# EAGLE schematic registers_manual (EAGLE 9.5.2)
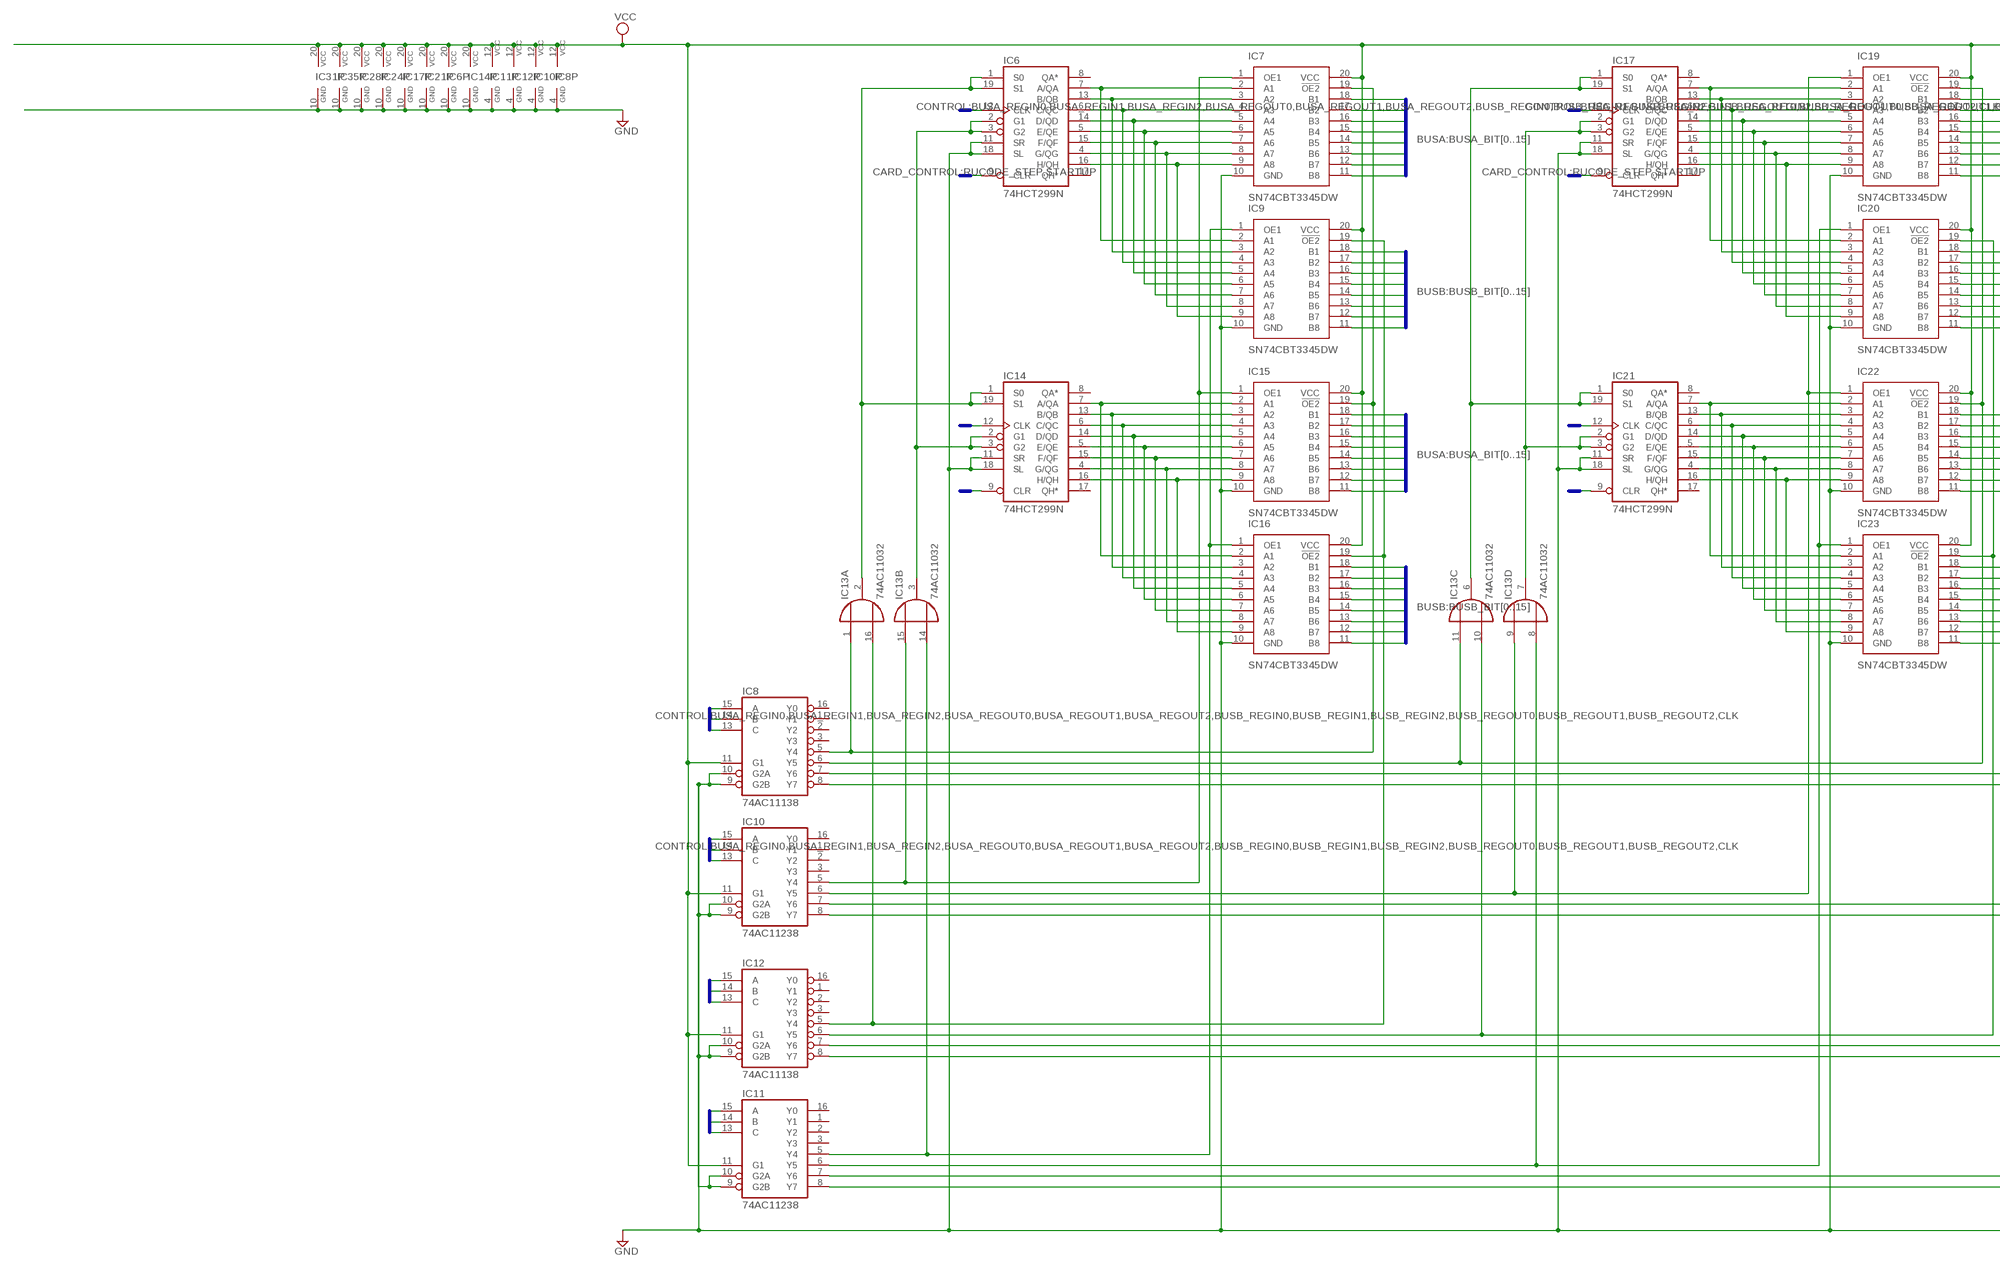
[diagram p0: schematic, sheet 1, part 1 of 2]
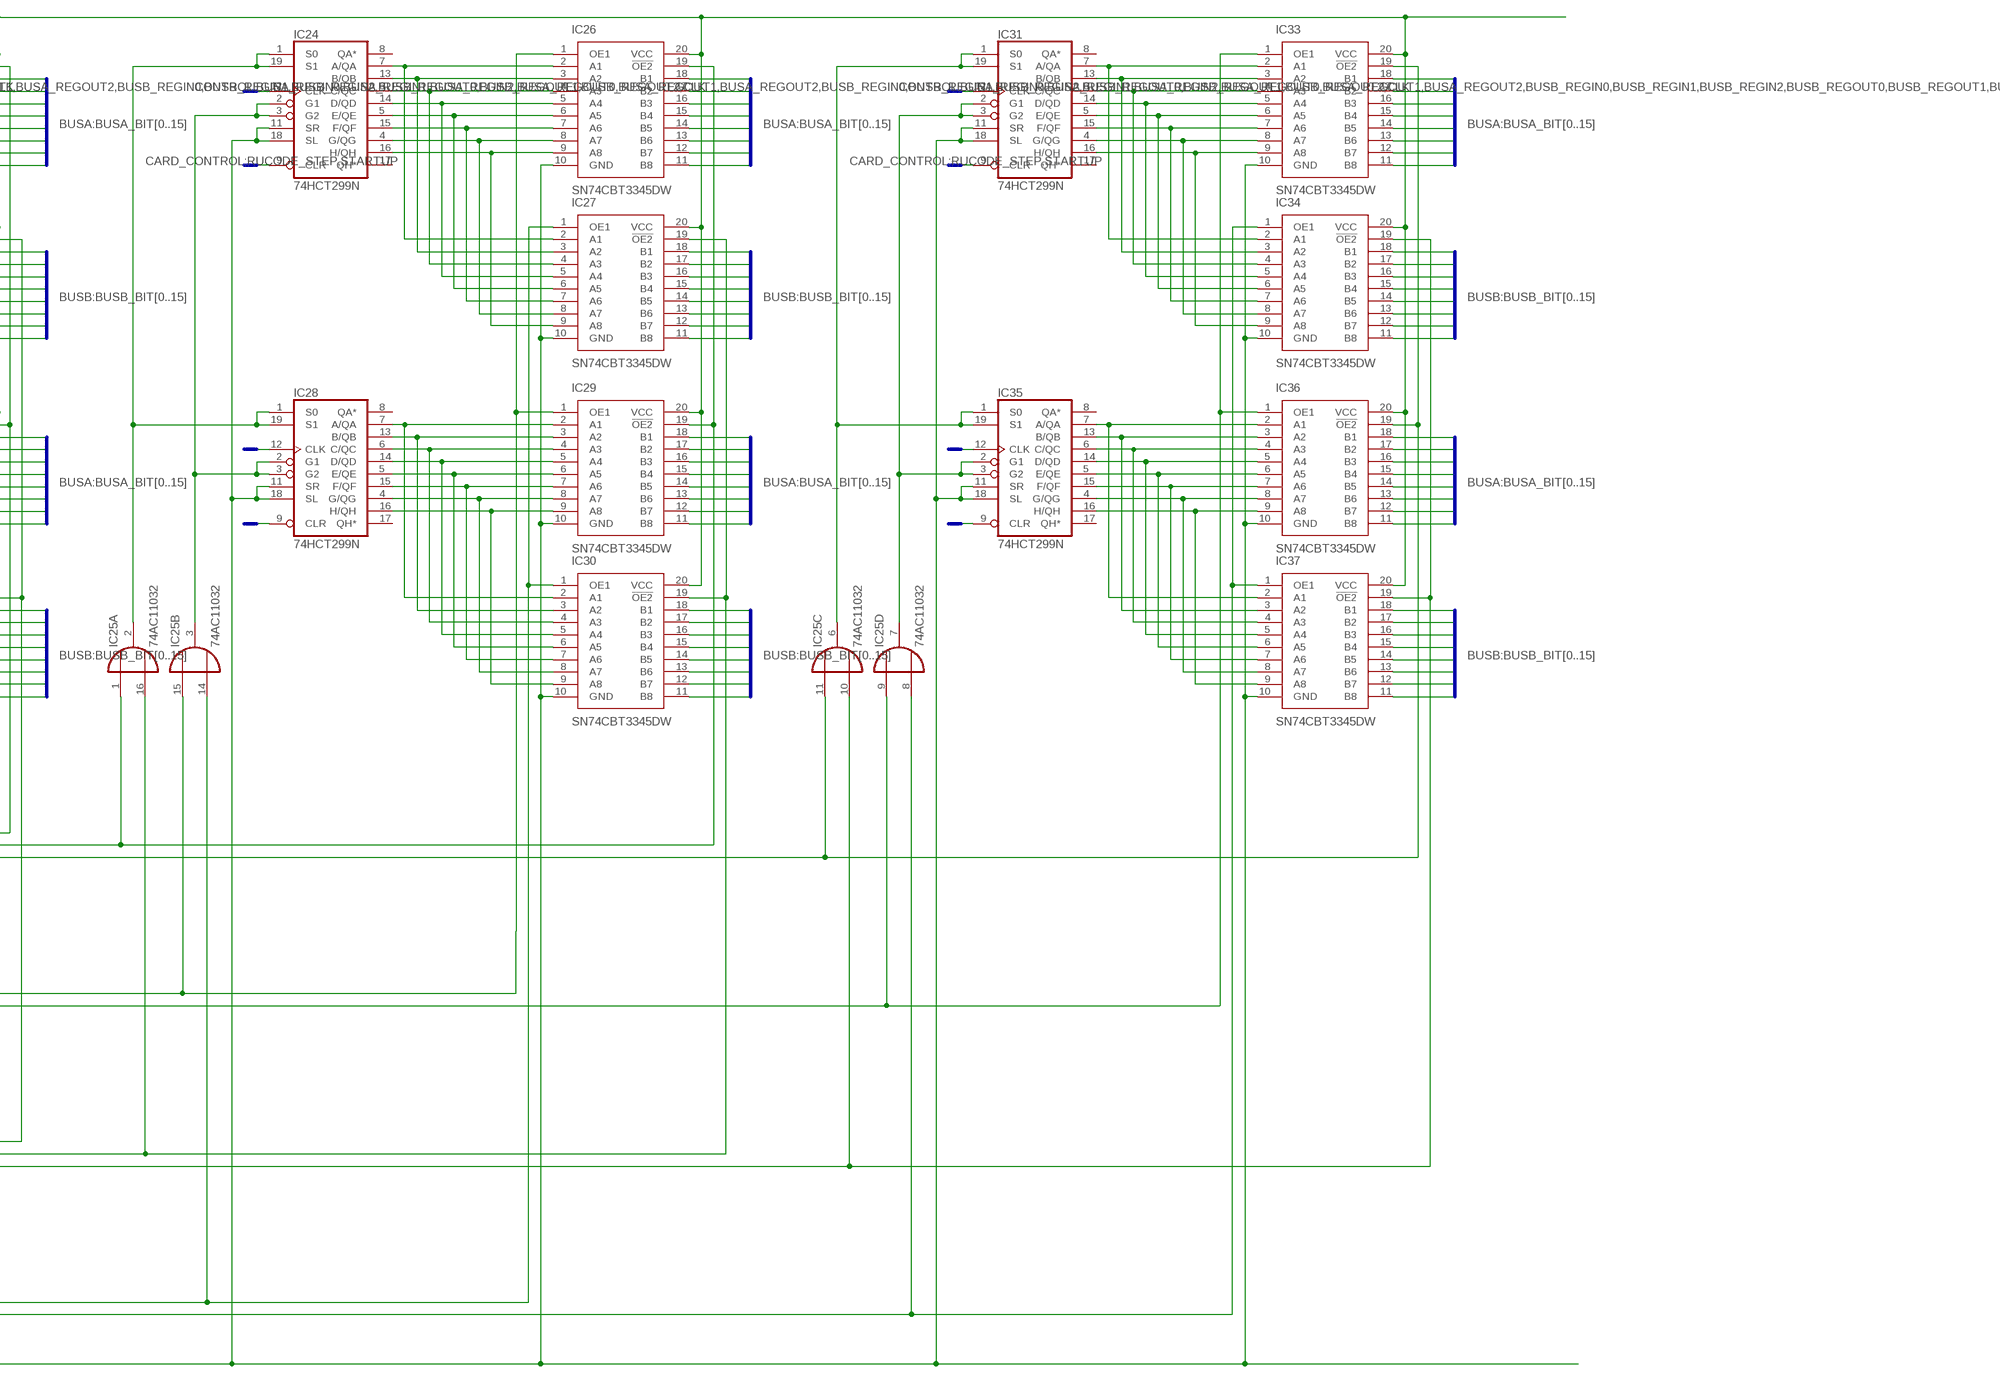
[diagram p1: schematic, sheet 1, part 2 of 2]

## Parts
IC6  74HCT299N  [DIL20]
IC7  SN74CBT3345DW  [SOIC127P1030X265-20N]
IC8  74AC11138  [DIL16]
IC9  SN74CBT3345DW  [SOIC127P1030X265-20N]
IC10  74AC11238  [DIL16]
IC11  74AC11238  [DIL16]
IC12  74AC11138  [DIL16]
IC13  74AC11032  [DIL16]
IC14  74HCT299N  [DIL20]
IC15  SN74CBT3345DW  [SOIC127P1030X265-20N]
IC16  SN74CBT3345DW  [SOIC127P1030X265-20N]
IC17  74HCT299N  [DIL20]
IC19  SN74CBT3345DW  [SOIC127P1030X265-20N]
IC20  SN74CBT3345DW  [SOIC127P1030X265-20N]
IC21  74HCT299N  [DIL20]
IC22  SN74CBT3345DW  [SOIC127P1030X265-20N]
IC23  SN74CBT3345DW  [SOIC127P1030X265-20N]
IC24  74HCT299N  [DIL20]
IC25  74AC11032  [DIL16]
IC26  SN74CBT3345DW  [SOIC127P1030X265-20N]
IC27  SN74CBT3345DW  [SOIC127P1030X265-20N]
IC28  74HCT299N  [DIL20]
IC29  SN74CBT3345DW  [SOIC127P1030X265-20N]
IC30  SN74CBT3345DW  [SOIC127P1030X265-20N]
IC31  74HCT299N  [DIL20]
IC33  SN74CBT3345DW  [SOIC127P1030X265-20N]
IC34  SN74CBT3345DW  [SOIC127P1030X265-20N]
IC35  74HCT299N  [DIL20]
IC36  SN74CBT3345DW  [SOIC127P1030X265-20N]
IC37  SN74CBT3345DW  [SOIC127P1030X265-20N]

## Nets
BUSA_BIT0: IC7.18(B1) IC19.18(B1) IC26.18(B1) IC33.18(B1)
BUSA_BIT1: IC7.17(B2) IC19.17(B2) IC26.17(B2) IC33.17(B2)
BUSA_BIT2: IC7.16(B3) IC19.16(B3) IC26.16(B3) IC33.16(B3)
BUSA_BIT3: IC7.15(B4) IC19.15(B4) IC26.15(B4) IC33.15(B4)
BUSA_BIT4: IC7.14(B5) IC19.14(B5) IC26.14(B5) IC33.14(B5)
BUSA_BIT5: IC7.13(B6) IC19.13(B6) IC26.13(B6) IC33.13(B6)
BUSA_BIT6: IC7.12(B7) IC19.12(B7) IC26.12(B7) IC33.12(B7)
BUSA_BIT7: IC7.11(B8) IC19.11(B8) IC26.11(B8) IC33.11(B8)
BUSA_BIT8: IC15.18(B1) IC22.18(B1) IC29.18(B1) IC36.18(B1)
BUSA_BIT9: IC15.17(B2) IC22.17(B2) IC29.17(B2) IC36.17(B2)
BUSA_BIT10: IC15.16(B3) IC22.16(B3) IC29.16(B3) IC36.16(B3)
BUSA_BIT11: IC15.15(B4) IC22.15(B4) IC29.15(B4) IC36.15(B4)
BUSA_BIT12: IC15.14(B5) IC22.14(B5) IC29.14(B5) IC36.14(B5)
BUSA_BIT13: IC15.13(B6) IC22.13(B6) IC29.13(B6) IC36.13(B6)
BUSA_BIT14: IC15.12(B7) IC22.12(B7) IC29.12(B7) IC36.12(B7)
BUSA_BIT15: IC15.11(B8) IC22.11(B8) IC29.11(B8) IC36.11(B8)
BUSA_REGIN0: IC8.15(A)
BUSA_REGIN1: IC8.14(B)
BUSA_REGIN2: IC8.13(C)
BUSA_REGOUT0: IC10.15(A)
BUSA_REGOUT1: IC10.14(B)
BUSA_REGOUT2: IC10.13(C)
BUSB_BIT0: IC9.18(B1) IC20.18(B1) IC27.18(B1) IC34.18(B1)
BUSB_BIT1: IC9.17(B2) IC20.17(B2) IC27.17(B2) IC34.17(B2)
BUSB_BIT2: IC9.16(B3) IC20.16(B3) IC27.16(B3) IC34.16(B3)
BUSB_BIT3: IC9.15(B4) IC20.15(B4) IC27.15(B4) IC34.15(B4)
BUSB_BIT4: IC9.14(B5) IC20.14(B5) IC27.14(B5) IC34.14(B5)
BUSB_BIT5: IC9.13(B6) IC20.13(B6) IC27.13(B6) IC34.13(B6)
BUSB_BIT6: IC9.12(B7) IC20.12(B7) IC27.12(B7) IC34.12(B7)
BUSB_BIT7: IC9.11(B8) IC20.11(B8) IC27.11(B8) IC34.11(B8)
BUSB_BIT8: IC16.18(B1) IC23.18(B1) IC30.18(B1) IC37.18(B1)
BUSB_BIT9: IC16.17(B2) IC23.17(B2) IC30.17(B2) IC37.17(B2)
BUSB_BIT10: IC16.16(B3) IC23.16(B3) IC30.16(B3) IC37.16(B3)
BUSB_BIT11: IC16.15(B4) IC23.15(B4) IC30.15(B4) IC37.15(B4)
BUSB_BIT12: IC16.14(B5) IC23.14(B5) IC30.14(B5) IC37.14(B5)
BUSB_BIT13: IC16.13(B6) IC23.13(B6) IC30.13(B6) IC37.13(B6)
BUSB_BIT14: IC16.12(B7) IC23.12(B7) IC30.12(B7) IC37.12(B7)
BUSB_BIT15: IC16.11(B8) IC23.11(B8) IC30.11(B8) IC37.11(B8)
BUSB_REGIN0: IC12.15(A)
BUSB_REGIN1: IC12.14(B)
BUSB_REGIN2: IC12.13(C)
BUSB_REGOUT0: IC11.15(A)
BUSB_REGOUT1: IC11.14(B)
BUSB_REGOUT2: IC11.13(C)
CLK: IC6.12(CLK) IC14.12(CLK) IC17.12(CLK) IC21.12(CLK) IC24.12(CLK) IC28.12(CLK) IC31.12(CLK) IC35.12(CLK)
GND: IC6.10(GND) IC6.11(SR) IC6.18(SL) IC7.10(GND) IC8.4(GND) IC8.9(G2B) IC8.10(G2A) IC9.10(GND) IC10.4(GND) IC10.9(G2B) IC10.10(G2A) IC11.4(GND) IC11.9(G2B) IC11.10(G2A) IC12.4(GND) IC12.9(G2B) IC12.10(G2A) IC14.10(GND) IC14.11(SR) IC14.18(SL) IC15.10(GND) IC16.10(GND) IC17.10(GND) IC17.11(SR) IC17.18(SL) IC19.10(GND) IC20.10(GND) IC21.10(GND) IC21.11(SR) IC21.18(SL) IC22.10(GND) IC23.10(GND) IC24.10(GND) IC24.11(SR) IC24.18(SL) IC26.10(GND) IC27.10(GND) IC28.10(GND) IC28.11(SR) IC28.18(SL) IC29.10(GND) IC30.10(GND) IC31.10(GND) IC31.11(SR) IC31.18(SL) IC33.10(GND) IC34.10(GND) IC35.10(GND) IC35.11(SR) IC35.18(SL) IC36.10(GND) IC37.10(GND)
N$8: IC6.7(A/QA) IC7.2(A1) IC9.2(A1)
N$10: IC7.19(!OE2) IC8.5(Y4) IC13.1(A:I1) IC15.19(!OE2)
N$18: IC6.13(B/QB) IC7.3(A2) IC9.3(A2)
N$19: IC6.2(G1) IC6.3(G2) IC13.3(B:O) IC14.2(G1) IC14.3(G2)
N$20: IC6.6(C/QC) IC7.4(A3) IC9.4(A3)
N$21: IC6.1(S0) IC6.19(S1) IC13.2(A:O) IC14.1(S0) IC14.19(S1)
N$22: IC14.7(A/QA) IC15.2(A1) IC16.2(A1)
N$23: IC14.13(B/QB) IC15.3(A2) IC16.3(A2)
N$24: IC14.6(C/QC) IC15.4(A3) IC16.4(A3)
N$25: IC8.7(Y6) IC25.1(A:I1) IC26.19(!OE2) IC29.19(!OE2)
N$26: IC6.14(D/QD) IC7.5(A4) IC9.5(A4)
N$27: IC6.5(E/QE) IC7.6(A5) IC9.6(A5)
N$28: IC14.14(D/QD) IC15.5(A4) IC16.5(A4)
N$29: IC14.5(E/QE) IC15.6(A5) IC16.6(A5)
N$30: IC14.15(F/QF) IC15.7(A6) IC16.7(A6)
N$31: IC14.4(G/QG) IC15.8(A7) IC16.8(A7)
N$32: IC9.1(OE1) IC11.5(Y4) IC13.14(B:I2) IC16.1(OE1)
N$33: IC9.19(!OE2) IC12.5(Y4) IC13.16(A:I2) IC16.19(!OE2)
N$34: IC7.1(OE1) IC10.5(Y4) IC13.15(B:I1) IC15.1(OE1)
N$35: IC14.16(H/QH) IC15.9(A8) IC16.9(A8)
N$41: IC6.15(F/QF) IC7.7(A6) IC9.7(A6)
N$43: IC6.4(G/QG) IC7.8(A7) IC9.8(A7)
N$44: IC13.6(C:O) IC17.1(S0) IC17.19(S1) IC21.1(S0) IC21.19(S1)
N$45: IC17.7(A/QA) IC19.2(A1) IC20.2(A1)
N$46: IC17.13(B/QB) IC19.3(A2) IC20.3(A2)
N$47: IC6.16(H/QH) IC7.9(A8) IC9.9(A8)
N$48: IC17.6(C/QC) IC19.4(A3) IC20.4(A3)
N$49: IC17.14(D/QD) IC19.5(A4) IC20.5(A4)
N$50: IC17.5(E/QE) IC19.6(A5) IC20.6(A5)
N$51: IC17.15(F/QF) IC19.7(A6) IC20.7(A6)
N$52: IC17.4(G/QG) IC19.8(A7) IC20.8(A7)
N$53: IC17.16(H/QH) IC19.9(A8) IC20.9(A8)
N$54: IC13.7(D:O) IC17.2(G1) IC17.3(G2) IC21.2(G1) IC21.3(G2)
N$56: IC21.7(A/QA) IC22.2(A1) IC23.2(A1)
N$57: IC21.13(B/QB) IC22.3(A2) IC23.3(A2)
N$58: IC21.6(C/QC) IC22.4(A3) IC23.4(A3)
N$59: IC21.14(D/QD) IC22.5(A4) IC23.5(A4)
N$60: IC21.5(E/QE) IC22.6(A5) IC23.6(A5)
N$61: IC21.15(F/QF) IC22.7(A6) IC23.7(A6)
N$62: IC21.4(G/QG) IC22.8(A7) IC23.8(A7)
N$63: IC21.16(H/QH) IC22.9(A8) IC23.9(A8)
N$69: IC24.1(S0) IC24.19(S1) IC25.2(A:O) IC28.1(S0) IC28.19(S1)
N$70: IC24.7(A/QA) IC26.2(A1) IC27.2(A1)
N$71: IC24.13(B/QB) IC26.3(A2) IC27.3(A2)
N$72: IC24.6(C/QC) IC26.4(A3) IC27.4(A3)
N$73: IC24.14(D/QD) IC26.5(A4) IC27.5(A4)
N$74: IC24.5(E/QE) IC26.6(A5) IC27.6(A5)
N$75: IC24.15(F/QF) IC26.7(A6) IC27.7(A6)
N$76: IC24.4(G/QG) IC26.8(A7) IC27.8(A7)
N$77: IC24.16(H/QH) IC26.9(A8) IC27.9(A8)
N$78: IC24.2(G1) IC24.3(G2) IC25.3(B:O) IC28.2(G1) IC28.3(G2)
N$80: IC28.7(A/QA) IC29.2(A1) IC30.2(A1)
N$81: IC28.13(B/QB) IC29.3(A2) IC30.3(A2)
N$82: IC28.6(C/QC) IC29.4(A3) IC30.4(A3)
N$83: IC28.14(D/QD) IC29.5(A4) IC30.5(A4)
N$84: IC28.5(E/QE) IC29.6(A5) IC30.6(A5)
N$85: IC28.15(F/QF) IC29.7(A6) IC30.7(A6)
N$86: IC28.4(G/QG) IC29.8(A7) IC30.8(A7)
N$87: IC28.16(H/QH) IC29.9(A8) IC30.9(A8)
N$93: IC25.6(C:O) IC31.1(S0) IC31.19(S1) IC35.1(S0) IC35.19(S1)
N$94: IC31.7(A/QA) IC33.2(A1) IC34.2(A1)
N$95: IC31.13(B/QB) IC33.3(A2) IC34.3(A2)
N$96: IC31.6(C/QC) IC33.4(A3) IC34.4(A3)
N$97: IC31.14(D/QD) IC33.5(A4) IC34.5(A4)
N$98: IC31.5(E/QE) IC33.6(A5) IC34.6(A5)
N$99: IC31.15(F/QF) IC33.7(A6) IC34.7(A6)
N$100: IC31.4(G/QG) IC33.8(A7) IC34.8(A7)
N$101: IC31.16(H/QH) IC33.9(A8) IC34.9(A8)
N$102: IC25.7(D:O) IC31.2(G1) IC31.3(G2) IC35.2(G1) IC35.3(G2)
N$104: IC35.7(A/QA) IC36.2(A1) IC37.2(A1)
N$105: IC35.13(B/QB) IC36.3(A2) IC37.3(A2)
N$106: IC35.6(C/QC) IC36.4(A3) IC37.4(A3)
N$107: IC35.14(D/QD) IC36.5(A4) IC37.5(A4)
N$108: IC35.5(E/QE) IC36.6(A5) IC37.6(A5)
N$109: IC35.15(F/QF) IC36.7(A6) IC37.7(A6)
N$110: IC35.4(G/QG) IC36.8(A7) IC37.8(A7)
N$111: IC35.16(H/QH) IC36.9(A8) IC37.9(A8)
N$112: IC8.6(Y5) IC13.11(C:I1) IC19.19(!OE2) IC22.19(!OE2)
N$113: IC10.6(Y5) IC13.9(D:I1) IC19.1(OE1) IC22.1(OE1)
N$114: IC12.6(Y5) IC13.10(C:I2) IC20.19(!OE2) IC23.19(!OE2)
N$115: IC11.6(Y5) IC13.8(D:I2) IC20.1(OE1) IC23.1(OE1)
N$117: IC10.7(Y6) IC25.15(B:I1) IC26.1(OE1) IC29.1(OE1)
N$118: IC12.7(Y6) IC25.16(A:I2) IC27.19(!OE2) IC30.19(!OE2)
N$119: IC11.7(Y6) IC25.14(B:I2) IC27.1(OE1) IC30.1(OE1)
N$120: IC11.8(Y7) IC25.8(D:I2) IC34.1(OE1) IC37.1(OE1)
N$121: IC12.8(Y7) IC25.10(C:I2) IC34.19(!OE2) IC37.19(!OE2)
N$122: IC8.8(Y7) IC25.11(C:I1) IC33.19(!OE2) IC36.19(!OE2)
N$123: IC10.8(Y7) IC25.9(D:I1) IC33.1(OE1) IC36.1(OE1)
STARTUP: IC6.9(CLR) IC14.9(CLR) IC17.9(CLR) IC21.9(CLR) IC24.9(CLR) IC28.9(CLR) IC31.9(CLR) IC35.9(CLR)
VCC: IC6.20(VCC) IC7.20(VCC) IC8.11(G1) IC8.12(VCC) IC9.20(VCC) IC10.11(G1) IC10.12(VCC) IC11.11(G1) IC11.12(VCC) IC12.11(G1) IC12.12(VCC) IC14.20(VCC) IC15.20(VCC) IC16.20(VCC) IC17.20(VCC) IC19.20(VCC) IC20.20(VCC) IC21.20(VCC) IC22.20(VCC) IC23.20(VCC) IC24.20(VCC) IC26.20(VCC) IC27.20(VCC) IC28.20(VCC) IC29.20(VCC) IC30.20(VCC) IC31.20(VCC) IC33.20(VCC) IC34.20(VCC) IC35.20(VCC) IC36.20(VCC) IC37.20(VCC)
Unconnected: IC6.8(QA*) IC6.17(QH*) IC8.1(Y1) IC8.2(Y2) IC8.3(Y3) IC8.16(Y0) IC10.1(Y1) IC10.2(Y2) IC10.3(Y3) IC10.16(Y0) IC11.1(Y1) IC11.2(Y2) IC11.3(Y3) IC11.16(Y0) IC12.1(Y1) IC12.2(Y2) IC12.3(Y3) IC12.16(Y0) IC14.8(QA*) IC14.17(QH*) IC17.8(QA*) IC17.17(QH*) IC21.8(QA*) IC21.17(QH*) IC24.8(QA*) IC24.17(QH*) IC28.8(QA*) IC28.17(QH*) IC31.8(QA*) IC31.17(QH*) IC35.8(QA*) IC35.17(QH*)

## Buses
CONTROL:BUSA_REGIN0,BUSA_REGIN1,BUSA_REGIN2,BUSA_REGOUT0,BUSA_REGOUT1,BUSA_REGOUT2,BUSB_REGIN0,BUSB_REGIN1,BUSB_REGIN2,BUSB_REGOUT0,BUSB_REGOUT1,BUSB_REGOUT2,CLK
CARD_CONTROL:RUCODE_STEP,STARTUP
BUSA:BUSA_BIT[0..15]
BUSB:BUSB_BIT[0..15]

## Power pins joined to a net without a drawn wire
GND: IC13.4(P:GND) IC13.5(P:GND) IC25.4(P:GND) IC25.5(P:GND)
VCC: IC13.12(P:VCC) IC13.13(P:VCC) IC25.12(P:VCC) IC25.13(P:VCC)

## Library data of the parts
IC6 IC14 IC17 IC21 IC24 IC28 IC31 IC35 = 74xx-eu:74*299: 8-bit universal SHIFT/STORAGE REGISTER
IC7 IC9 IC15 IC16 IC19 IC20 IC22 IC23 IC26 IC27 IC29 IC30 IC33 IC34 IC36 IC37 = SamacSys_Parts:SN74CBT3345DW: Texas Instruments SN74CBT3345DW, Bus Switch, 8 x 1:1, 4.5 5.5 V, 20-Pin SOIC Source: Datasheet <https://www.ti.com/lit/ds/symlink/sn74cbt3345.pdf>; DESCRIPTION: Texas Instruments SN74CBT3345DW, Bus Switch, 8 x 1:1, 4.5 5.5 V, 20-Pin SOIC; HEIGHT: 2.65mm; MANUFACTURER_NAME: Texas Instruments; MANUFACTURER_PART_NUMBER: SN74CBT3345DW
IC8 IC12 = 74ac-logic:74AC11138: 3 to 8 line DECODER/DEMULTIPLEXER
IC10 IC11 = 74ac-logic:74AC11238: 3 to 8 line DECODER/DEMULTIPLEXER
IC13 IC25 = 74ac-logic:74AC11032: Quadruple 2-input OR